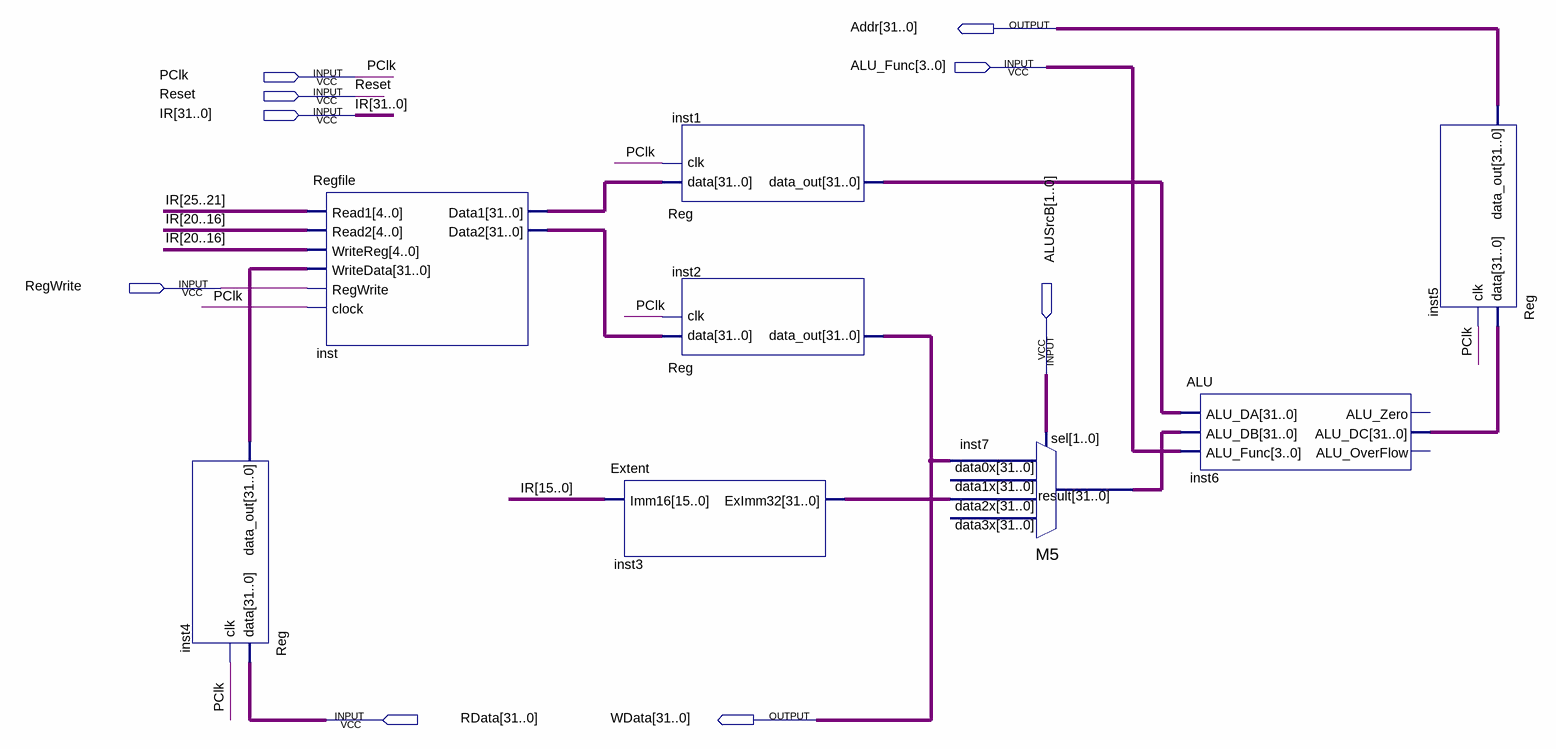
[diagram p0: schematic sheet]
// Quartus schematic saveload.bdf as structural Verilog: 8 symbols, 9 pins
module saveload (
  input  [3:0] ALU_Func,
  input  PClk,
  input  Reset,
  input  [31:0] IR,
  input  RegWrite,
  input  [1:0] ALUSrcB,
  input  [31:0] RData,
  output [31:0] Addr,
  output [31:0] WData
);

  wire [31:0] inst1_data_out, inst3_eximm32, inst4_data_out, inst6_alu_dc, inst7_result, inst_data1,
       inst_data2;

  Reg inst4 (.data(RData), .clk(PClk), .data_out(inst4_data_out));
  Regfile inst (
    .Read1(IR[25:21]), .Read2(IR[20:16]), .WriteReg(IR[20:16]), .WriteData(inst4_data_out),
    .RegWrite(RegWrite), .clock(PClk), .Data1(inst_data1), .Data2(inst_data2));
  Extent inst3 (.Imm16(IR[15:0]), .ExImm32(inst3_eximm32));
  Reg inst1 (.data(inst_data1), .clk(PClk), .data_out(inst1_data_out));
  Reg inst2 (.data(inst_data2), .clk(PClk), .data_out(WData));
  M5 inst7 (.data2x(inst3_eximm32), .data0x(WData), .sel(ALUSrcB), .result(inst7_result));  // open: data3x, data1x
  ALU inst6 (
    .ALU_DA(inst1_data_out), .ALU_DB(inst7_result), .ALU_Func(ALU_Func), .ALU_DC(inst6_alu_dc));  // open: ALU_Zero, ALU_OverFlow
  Reg inst5 (.data(inst6_alu_dc), .clk(PClk), .data_out(Addr));
endmodule
